# EAGLE schematic CTS_Teensy_Board (EAGLE 9.3.0)
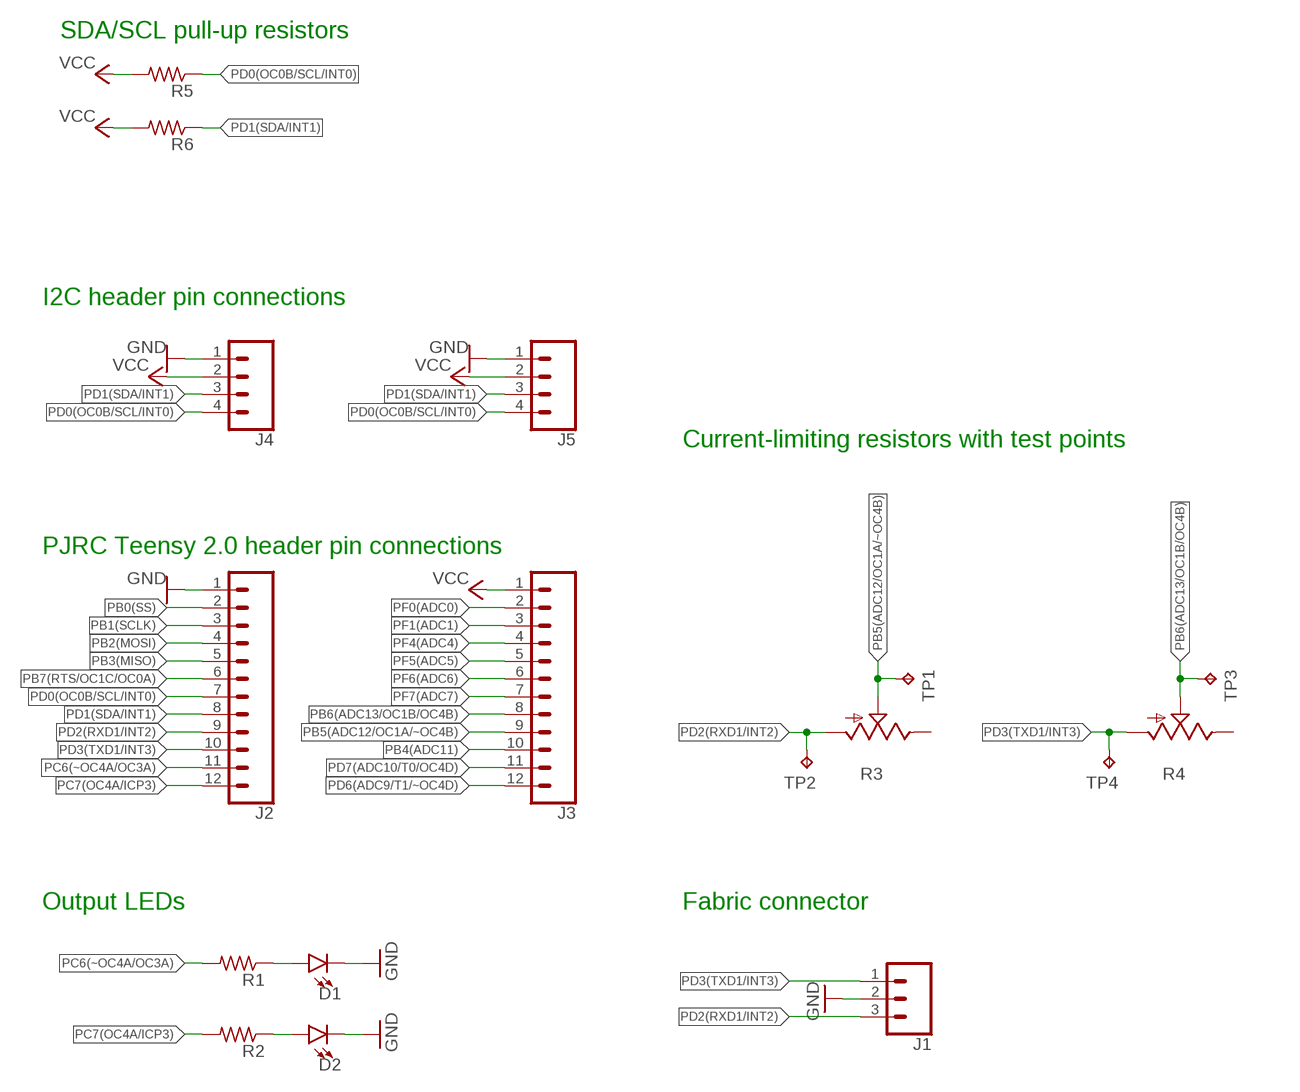
[diagram p0: schematic, sheet 1]

## Parts
D1  LED3MM  [LED_3MM]
D2  LED3MM  [LED_3MM]
J1  CONN_03POLAR  [MOLEX-1X3]
J2  CONN_12  [1X12]
J3  CONN_12  [1X12]
J4  CONN_04  [1X04]
J5  CONN_04  [1X04]
R1  R-US_0204/7  [0204/7]
R2  R-US_0204/7  [0204/7]
R3  TRIM_US-B90P  [SP19L]
R4  TRIM_US-B90P  [SP19L]
R5  R-US_0204/7  [0204/7]
R6  R-US_0204/7  [0204/7]
TP1  TPTP18R  [TP18R]
TP2  TPTP18R  [TP18R]
TP3  TPTP18R  [TP18R]
TP4  TPTP18R  [TP18R]

## Nets
GND: D1.K(C) D2.K(C) J1.2 J2.1 J4.1 J5.1
N$31: D2.A R2.1
N$32: D1.A R1.1
PB0(SS): J2.2
PB1(SCLK): J2.3
PB2(MOSI): J2.4
PB3(MISO): J2.5
PB4(ADC11): J3.10
PB5(ADC12/OC1A/~OC4B): J3.9 R3.S TP1.TP
PB6(ADC13/OC1B/OC4B): J3.8 R4.S TP3.TP
PB7(RTS/OC1C/OC0A): J2.6
PC6(~OC4A/OC3A): J2.11 R1.2
PC7(OC4A/ICP3): J2.12 R2.2
PD0(OC0B/SCL/INT0): J2.7 J4.4 J5.4 R5.1
PD1(SDA/INT1): J2.8 J4.3 J5.3 R6.1
PD2(RXD1/INT2): J1.3 J2.9 R3.A TP2.TP
PD3(TXD1/INT3): J1.1 J2.10 R4.A TP4.TP
PD6(ADC9/T1/~OC4D): J3.12
PD7(ADC10/T0/OC4D): J3.11
PF0(ADC0): J3.2
PF1(ADC1): J3.3
PF4(ADC4): J3.4
PF5(ADC5): J3.5
PF6(ADC6): J3.6
PF7(ADC7): J3.7
VCC: J3.1 J4.2 J5.2 R5.2 R6.2
Unconnected: R3.E R4.E

## Notes on the sheet
- SDA/SCL pull-up resistors
- I2C header pin connections
- Current-limiting resistors with test points
- PJRC Teensy 2.0 header pin connections
- Output LEDs | Fabric connector

## Library data of the parts
D1 D2 = SparkFun-LED:LED: LED (Generic) Standard schematic elements and footprints for 5mm, 3mm, 1206, and 0603 sized LEDs. Generic LEDs with no color specified.; PROD_ID: DIO-08794
J1 = SparkFun-Connectors:CONN_03: Multi connection point. Often used as Generic Header-pin footprint for 0.1 inch spaced/style header connections On any of the 0.1 inch spaced packages, you can populate with these: Break Away Headers - Straight <https://www.sparkfun.com/products/116> (PRT-00116) Break Away Male Headers - Right Angle <https://www.sparkfun.com/products/553> (PRT-00553) Female Headers <https://www.sparkfun.com/products/115> (PRT-00115) Break Away Headers - Machine Pin <https://www.sparkfun.com/products/117> (PRT-00117) Break Away Female Headers - Swiss Machine Pin <https://www.sparkfun.com/products/743> (PRT-00743) Stackable Header - 3 Pin (Female, 0.1") <https://www.sparkfun.com/products/13875> (PRT-13875) For SCREWTERMINALS and SPRING TERMINALS visit here: Screw Terimnals on SparkFun.com <https://www.sparkfun.com/search/results?term=Screw+Terminals> (5mm/3.5mm/2.54mm spacing) This device is also useful as a general connection point to wire up your design to another part of your project. Our various solder wires solder well into these plated through hole pads. Hook-Up Wire - Assortment (Stranded, 22 AWG) <https://www.sparkfun.com/products/11375> (PRT-11375) Hook-Up Wire - Assortment (Solid Core, 22 AWG) <https://www.sparkfun.com/products/11367> (PRT-11367) View the entire wire category on our website here <https://www.sparkfun.com/categories/141> Special notes: Molex polarized connector foot print use with SKU : PRT-08232 with associated crimp pins and housings.; PROD_ID: CONN-08625; SF_ID: PRT-08096
J2 J3 = SparkFun-Connectors:CONN_12: Multi connection point. Often used as Generic Header-pin footprint for 0.1 inch spaced/style header connections On any of the 0.1 inch spaced packages, you can populate with these: Break Away Headers - Straight <https://www.sparkfun.com/products/116> (PRT-00116) Break Away Male Headers - Right Angle <https://www.sparkfun.com/products/553> (PRT-00553) Female Headers <https://www.sparkfun.com/products/115> (PRT-00115) Break Away Headers - Machine Pin <https://www.sparkfun.com/products/117> (PRT-00117) Break Away Female Headers - Swiss Machine Pin <https://www.sparkfun.com/products/743> (PRT-00743) For SCREWTERMINALS and SPRING TERMINALS visit here: Screw Terimnals on SparkFun.com <https://www.sparkfun.com/search/results?term=Screw+Terminals> (5mm/3.5mm/2.54mm spacing) This device is also useful as a general connection point to wire up your design to another part of your project. Our various solder wires solder well into these plated through hole pads. Hook-Up Wire - Assortment (Stranded, 22 AWG) <https://www.sparkfun.com/products/11375> (PRT-11375) Hook-Up Wire - Assortment (Solid Core, 22 AWG) <https://www.sparkfun.com/products/11367> (PRT-11367) View the entire wire category on our website here <https://www.sparkfun.com/categories/141> Special notes: Molex polarized connector foot print use with SKU : PRT-08231 with associated crimp pins and housings. 1MM SMD Version SKU: PRT-10208 NOTES ON THE VARIANTS LOCK and LOCK_LONGPADS... This footprint was designed to help hold the alignment of a through-hole component (i.e. 6-pin header) while soldering it into place. You may notice that each hole has been shifted either up or down by 0.005 of an inch from it's more standard position (which is a perfectly straight line). This slight alteration caused the pins (the squares in the middle) to touch the edges of the holes. Because they are alternating, it causes a "brace" to hold the component in place. 0.005 has proven to be the perfect amount of "off-center" position when using our standard breakaway headers. Although looks a little odd when you look at the bare footprint, once you have a header in there, the alteration is very hard to notice. Also,if you push a header all the way into place, it is covered up entirely on the bottom side.
J4 J5 = SparkFun-Connectors:CONN_04: Multi connection point. Often used as Generic Header-pin footprint for 0.1 inch spaced/style header connections On any of the 0.1 inch spaced packages, you can populate with these: Break Away Headers - Straight <https://www.sparkfun.com/products/116> (PRT-00116) Break Away Male Headers - Right Angle <https://www.sparkfun.com/products/553> (PRT-00553) Female Headers <https://www.sparkfun.com/products/115> (PRT-00115) Break Away Headers - Machine Pin <https://www.sparkfun.com/products/117> (PRT-00117) Break Away Female Headers - Swiss Machine Pin <https://www.sparkfun.com/products/743> (PRT-00743) For SCREWTERMINALS and SPRING TERMINALS visit here: Screw Terimnals on SparkFun.com <https://www.sparkfun.com/search/results?term=Screw+Terminals> (5mm/3.5mm/2.54mm spacing) This device is also useful as a general connection point to wire up your design to another part of your project. Our various solder wires solder well into these plated through hole pads. Hook-Up Wire - Assortment (Stranded, 22 AWG) <https://www.sparkfun.com/products/11375> (PRT-11375) Hook-Up Wire - Assortment (Solid Core, 22 AWG) <https://www.sparkfun.com/products/11367> (PRT-11367) View the entire wire category on our website here <https://www.sparkfun.com/categories/141> Special notes: Molex polarized connector foot print use with SKU : PRT-08231 with associated crimp pins and housings. 1MM SMD Version SKU: PRT-10208; PROD_ID: CONN-09696
R1 R2 R5 R6 = adafruit:R-US_: RESISTOR, American symbol
R3 R4 = pot:TRIM_US-: POTENTIOMETER
TP1-TP4 = testpad:TP: Test pad